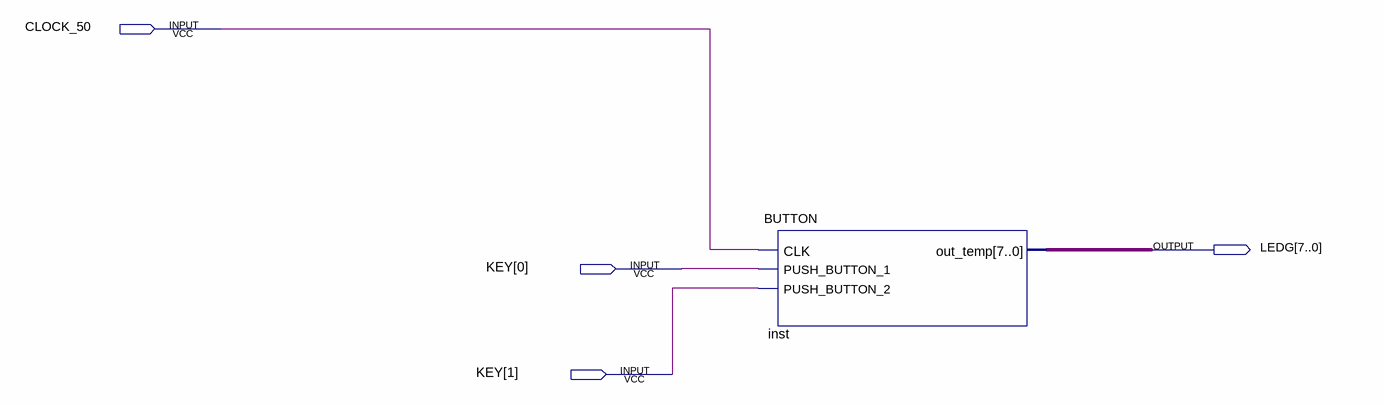
[diagram p0: schematic sheet]
// Quartus schematic BUTTON_Demo.bdf as structural Verilog: 1 symbols, 4 pins
module BUTTON_Demo (
  input  CLOCK_50,
  input  [1:0] KEY,
  output [7:0] LEDG
);

  BUTTON inst (.CLK(CLOCK_50), .PUSH_BUTTON_1(KEY[0]), .PUSH_BUTTON_2(KEY[1]), .out_temp(LEDG));
endmodule
